# EAGLE design c100_rev_c (EAGLE 7.6.0)
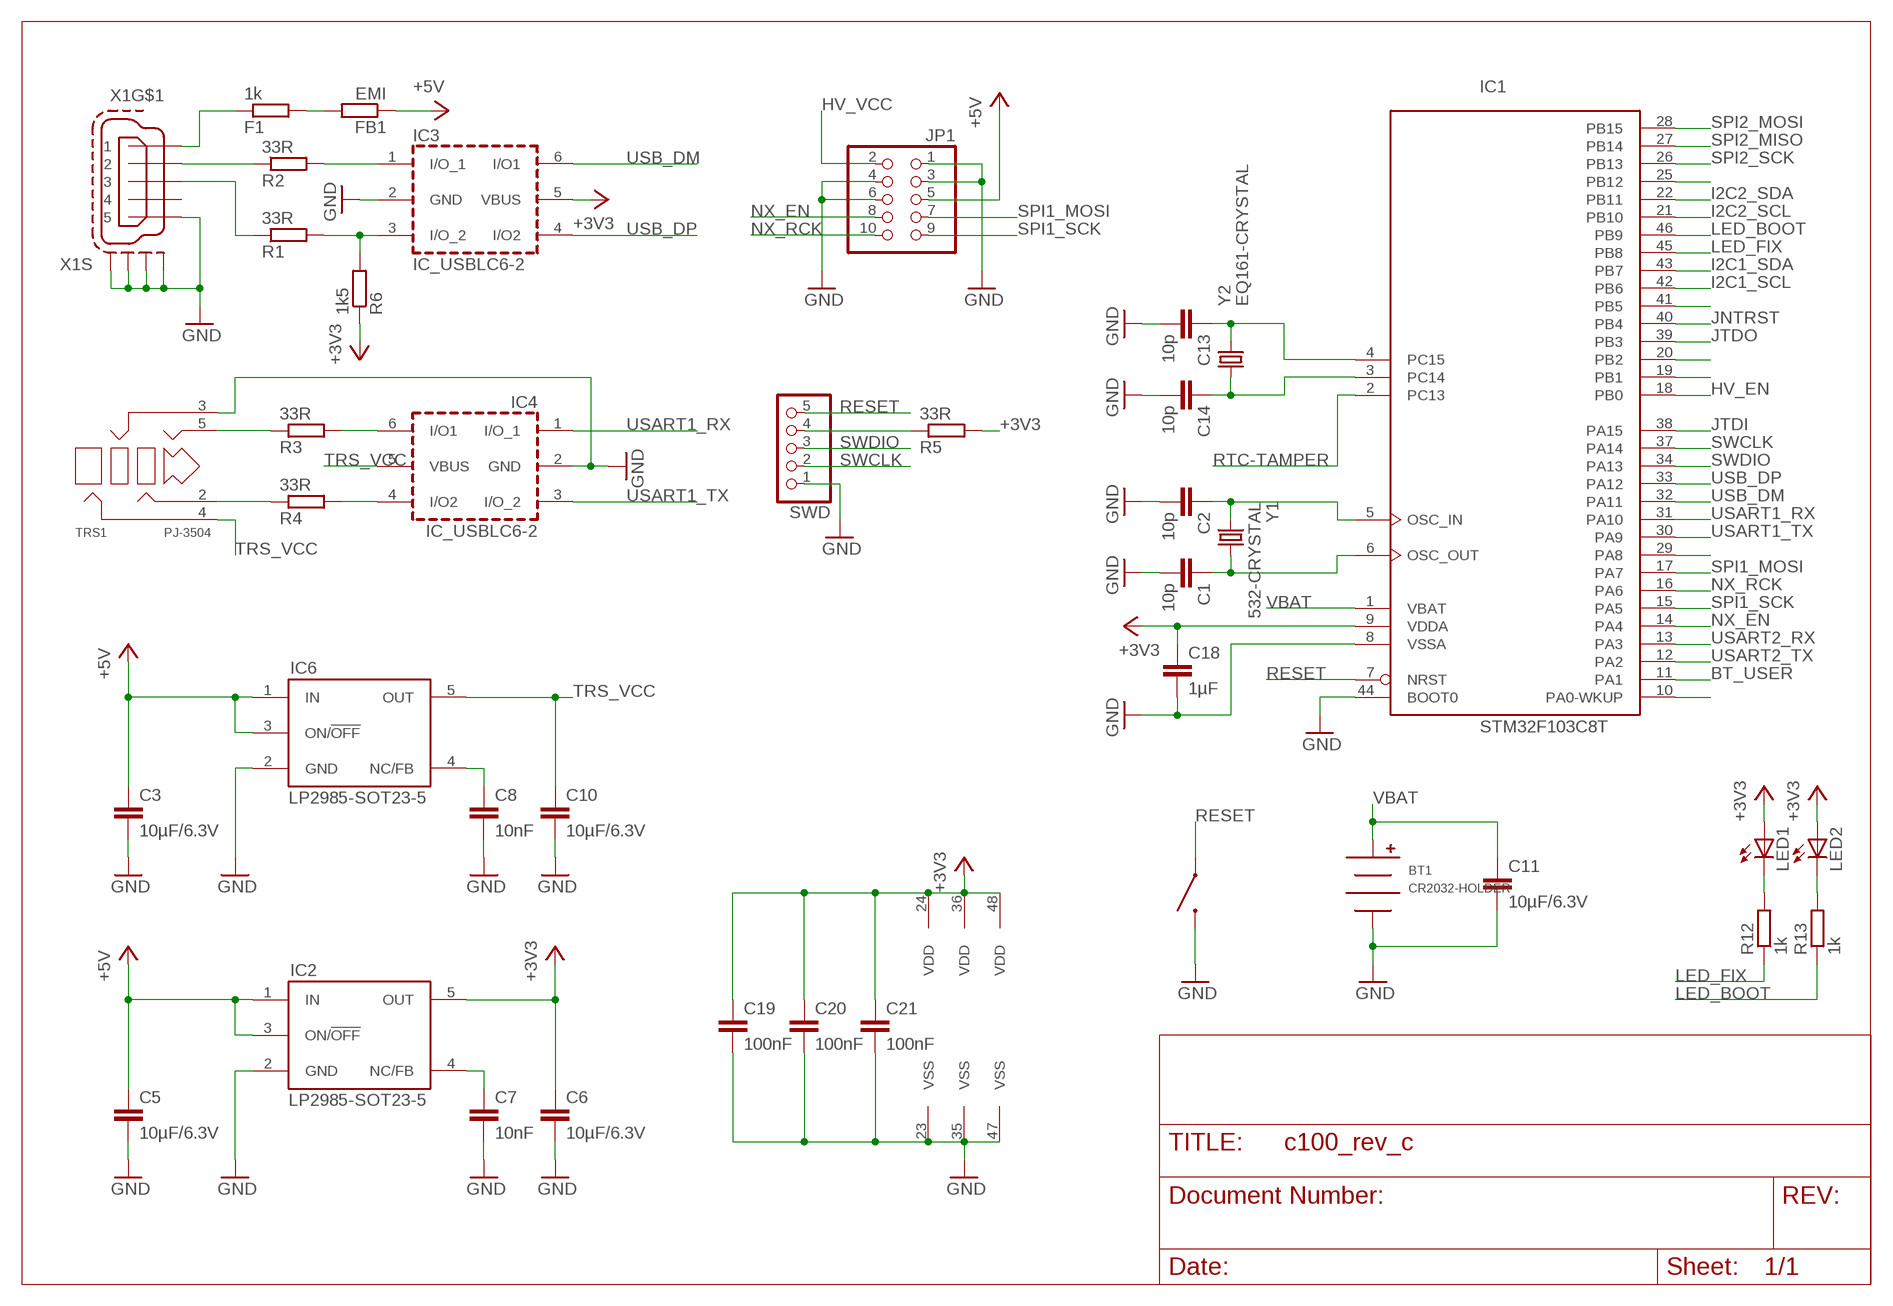
[diagram p0: schematic, sheet 1, part 1 of 2]
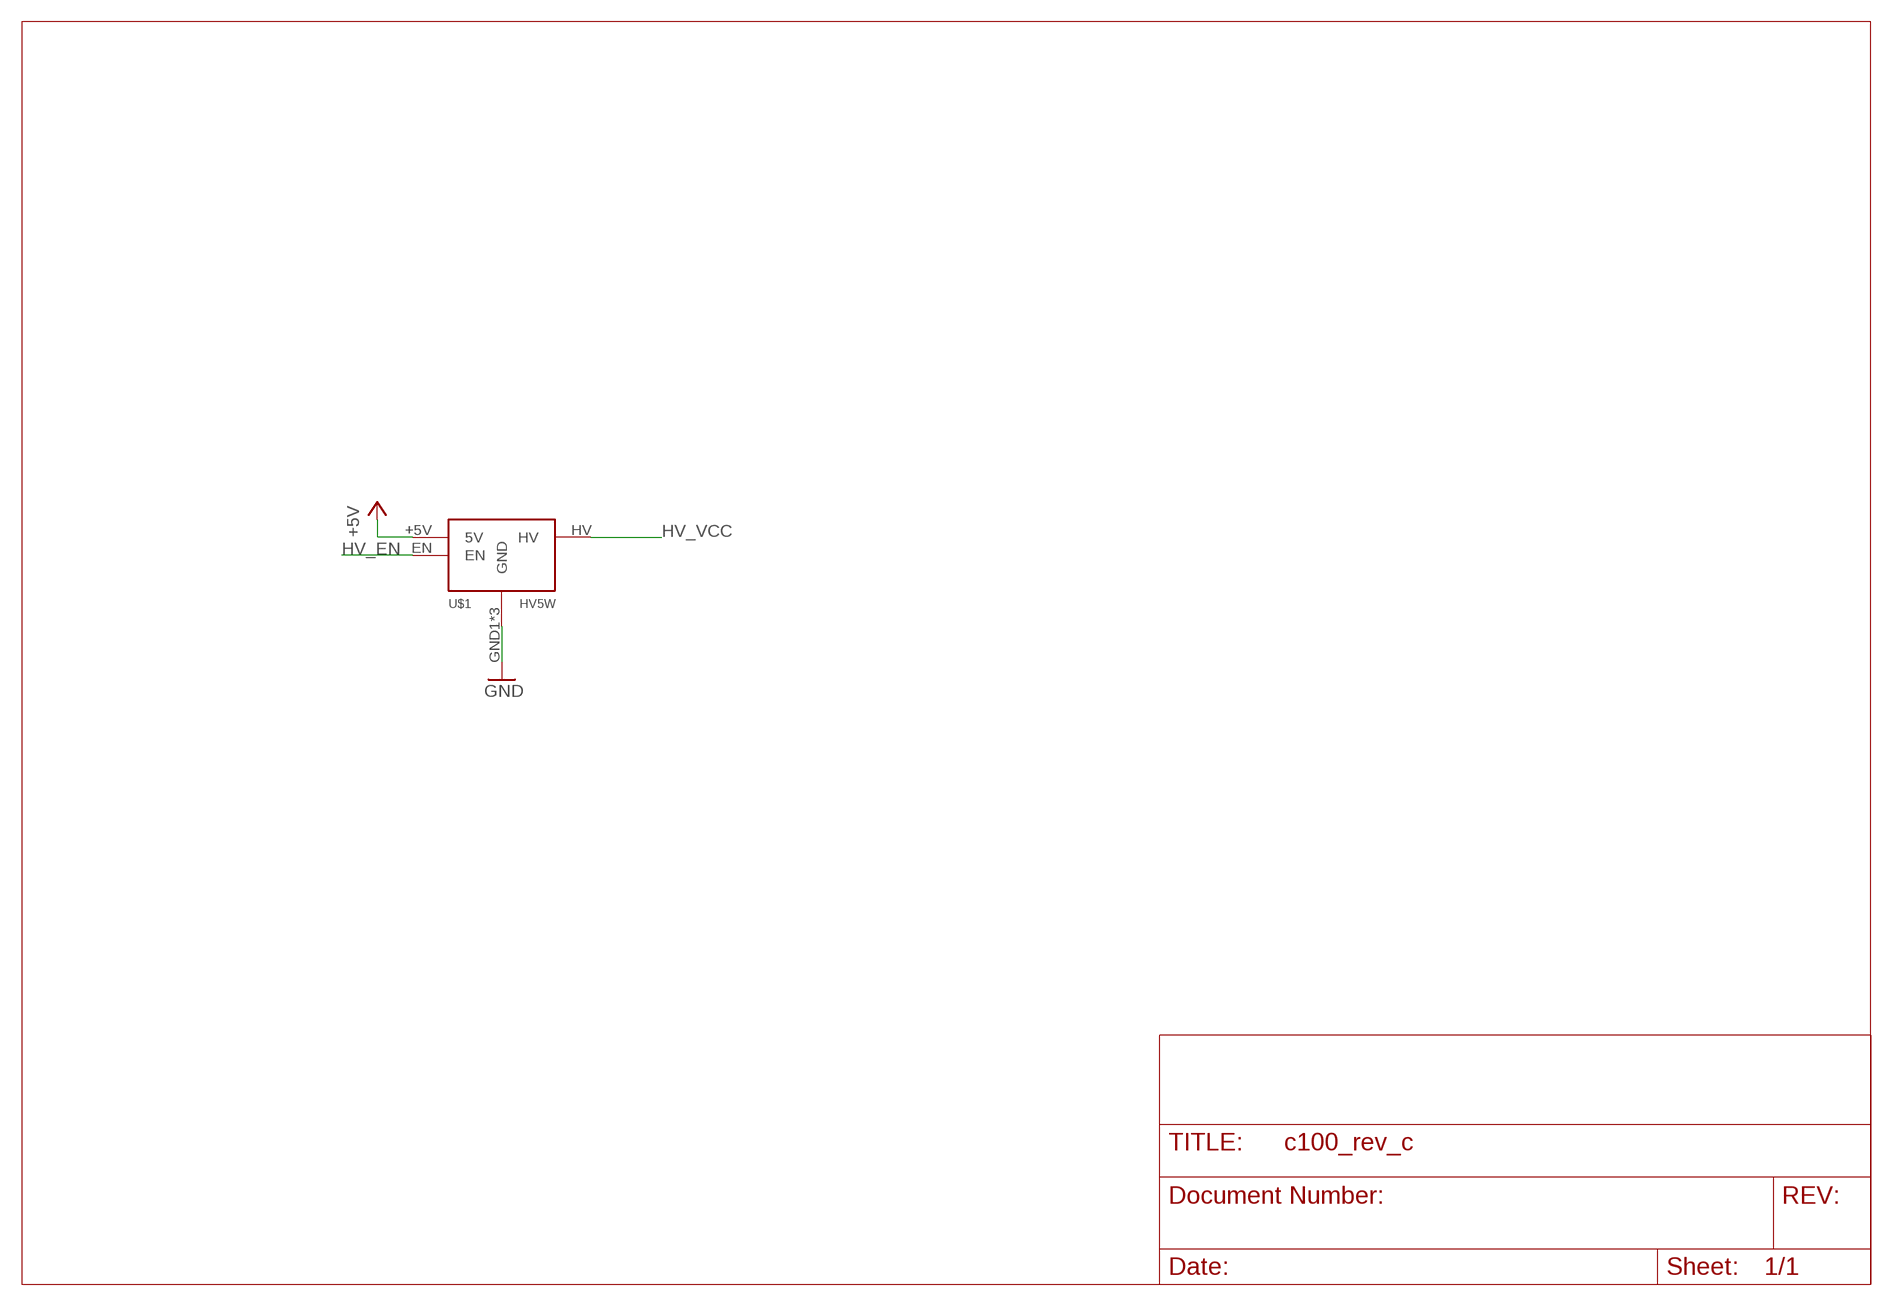
[diagram p1: schematic, sheet 1, part 2 of 2]

## Parts
BT1  CR2032-HOLDER  [CH28-2032LF]
C1  10p  C-EUC0603  [C0603]
C2  10p  C-EUC0603  [C0603]
C3  10µF/6.3V  C-EUC0603  [C0603]
C5  10µF/6.3V  C-EUC0603  [C0603]
C6  10µF/6.3V  C-EUC0603  [C0603]
C7  10nF  C-EUC0603  [C0603]
C8  10nF  C-EUC0603  [C0603]
C10  10µF/6.3V  C-EUC0603  [C0603]
C11  10µF/6.3V  C-EUC0603  [C0603]
C13  10p  C-EUC0603  [C0603]
C14  10p  C-EUC0603  [C0603]
C18  1µF  C-EUC0603  [C0603]
C19  100nF  C-EUC0603  [C0603]
C20  100nF  C-EUC0603  [C0603]
C21  100nF  C-EUC0603  [C0603]
F1  1k  R-EU_R0603  [R0603]
FB1  EMI  R-EU_R0603  [R0603]
IC1  STM32F103C8T  [LQFP48]
IC2  LP2985-SOT23-5  [SOT23-5]
IC3  IC_USBLC6-2  [SOT-23-6L]
IC4  IC_USBLC6-2  [SOT-23-6L]
IC6  LP2985-SOT23-5  [SOT23-5]
ISP  TACT-SWITCH-40-40  [40-40]
JP1  PINHD-2X5_2.54-SMD  [2X05SMD]
LED1  LEDCHIP-LED0603  [CHIP-LED0603]
LED2  LEDCHIP-LED0603  [CHIP-LED0603]
R1  33R  R-EU_R0603  [R0603]
R2  33R  R-EU_R0603  [R0603]
R3  33R  R-EU_R0603  [R0603]
R4  33R  R-EU_R0603  [R0603]
R5  33R  R-EU_R0603  [R0603]
R6  1k5  R-EU_R0603  [R0603]
R12  1k  R-EU_R0603  [R0603]
R13  1k  R-EU_R0603  [R0603]
SWD  HEADER-1X5ROUND  [1X05_ROUND]
TRS1  PJ-3504  [YD-PJ-3504]
U$1  HV5W  [HV5W-D]
X1  MINI-USB-SCHIELD-32005-201  [32005-201]
Y1  532-CRYSTAL  [2PIN50X32]
Y2  EQ161-CRYSTAL  [EQ161]

## Nets
+3V3: C6.1 C18.1 C19.1 C20.1 C21.1 IC1.9(VDDA) IC1.24(VDD) IC1.36(VDD) IC1.48(VDD) IC2.5(OUT) IC3.5(VBUS) LED1.A LED2.A R5.2 R6.1
+5V: C3.1 C5.1 FB1.1 IC2.1(IN) IC2.3(ON/!OFF) IC6.1(IN) IC6.3(ON/!OFF) JP1.5 U$1.+5V(5V)
ASDAWJIODJA: R5.1 SWD.4
BT_USER: IC1.11(PA1)
GND: BT1.NEG C1.2 C2.2 C3.2 C5.2 C6.2 C7.2 C8.2 C10.2 C11.2 C13.2 C14.2 C18.2 C19.2 C20.2 C21.2 IC1.8(VSSA) IC1.23(VSS) IC1.35(VSS) IC1.44(BOOT0) IC1.47(VSS) IC2.2(GND) IC3.2(GND) IC4.2(GND) IC6.2(GND) ISP.1 ISP.2 JP1.1 JP1.3 JP1.4 JP1.6 SWD.1 TRS1.3 U$1.GND1(GND) U$1.GND2(GND) U$1.GND3(GND) X1.5 X1.M1(S:S1) X1.M2(S:S2) X1.M3(S:S3) X1.M4(S:S4)
HV_EN: IC1.18(PB0) U$1.EN
HV_VCC: JP1.2 U$1.HV
I2C1_SCL: IC1.42(PB6)
I2C1_SDA: IC1.43(PB7)
I2C2_SCL: IC1.21(PB10)
I2C2_SDA: IC1.22(PB11)
JNTRST: IC1.40(PB4)
JTDI: IC1.38(PA15)
JTDO: IC1.39(PB3)
LED_BOOT: IC1.46(PB9) R13.1
LED_FIX: IC1.45(PB8) R12.1
N$1: C1.1 IC1.6(OSC_OUT) Y1.P$1
N$2: C2.1 IC1.5(OSC_IN) Y1.P$2
N$3: F1.1 X1.1
N$4: C8.1 IC6.4(NC/FB)
N$5: IC3.3(I/O_2) R1.2 R6.2
N$7: IC4.6(I/O1) R3.2
N$10: LED2.C R13.2
N$11: LED1.C R12.2
N$12: R4.1 TRS1.2
N$20: C7.1 IC2.4(NC/FB)
N$22: F1.2 FB1.2
N$23: IC3.1(I/O_1) R2.2
N$24: R2.1 X1.2
N$25: IC4.4(I/O2) R4.2
N$28: R3.1 TRS1.5
N$29: C13.1 IC1.4(PC15) Y2.P$1
N$30: C14.1 IC1.3(PC14) Y2.P$2
N$32: IC1.19(PB1)
N$34: IC1.20(PB2)
N$36: R1.1 X1.3
N$38: IC1.29(PA8)
N$42: IC1.10(PA0-WKUP)
N$48: IC1.41(PB5)
N$55: IC1.25(PB12)
NX_EN: IC1.14(PA4) JP1.8
NX_RCK: IC1.16(PA6) JP1.10
RESET: IC1.7(NRST) ISP.3 ISP.4 SWD.5
RTC-TAMPER: IC1.2(PC13)
SPI1_MOSI: IC1.17(PA7) JP1.7
SPI1_SCK: IC1.15(PA5) JP1.9
SPI2_MISO: IC1.27(PB14)
SPI2_MOSI: IC1.28(PB15)
SPI2_SCK: IC1.26(PB13)
SWCLK: IC1.37(PA14) SWD.2
SWDIO: IC1.34(PA13) SWD.3
TRS_VCC: C10.1 IC4.5(VBUS) IC6.5(OUT) TRS1.4
USART1_RX: IC1.31(PA10) IC4.1(I/O_1)
USART1_TX: IC1.30(PA9) IC4.3(I/O_2)
USART2_RX: IC1.13(PA3)
USART2_TX: IC1.12(PA2)
USB_DM: IC1.32(PA11) IC3.6(I/O1)
USB_DP: IC1.33(PA12) IC3.4(I/O2)
VBAT: BT1.POS C11.1 IC1.1(VBAT)
Unconnected: X1.4

## Library data of the parts
BT1 = battery-holder:CR2032-HOLDER
C1-C3 C5-C8 C10 C11 C13 C14 C18-C21 = rcl:C-EU: CAPACITOR, European symbol
F1 FB1 R1-R6 R12 R13 = rcl:R-EU_: RESISTOR, European symbol
IC1 = micro-stm_v3:STM32F103C*T: ARM 32-bit Cortex™-M3 CPU 72 MHz maximum frequency 16 to 128 Kbytes of Flash memory 6 to 20 kbytes of SRAM 37 GPIOs 2.0 to 3.6 V application supply
IC2 IC6 = vreg:LP2985
IC3 IC4 = dp_devices:IC_USBLC6-2
ISP = tactile-switch:TACT-SWITCH-40-40
JP1 = con-pinhead:PINHD-2X5: PIN HEADER
LED1 LED2 = led:LED: LED OSRAM: - CHIPLED LG R971, LG N971, LY N971, LG Q971, LY Q971, LO R971, LY R971 LH N974, LH R974 LS Q976, LO Q976, LY Q976 LO Q996 - Hyper CHIPLED LW Q18S LB Q993, LB Q99A, LB R99A - SideLED LS A670, LO A670, LY A670, LG A670, LP A670 LB A673, LV A673, LT A673, LW A673 LH A674 LY A675 LS A676, LA A676, LO A676, LY A676, LW A676 LS A679, LY A679, LG A679 - Hyper Micro SIDELED® LS Y876, LA Y876, LO Y876, LY Y876 LT Y87S - SmartLED LW L88C, LW L88S LB L89C, LB L89S, LG L890 LS L89K, LO L89K, LY L89K LS L896, LA L896, LO L896, LY L896 - TOPLED LS T670, LO T670, LY T670, LG T670, LP T670 LSG T670, LSP T670, LSY T670, LOP T670, LYG T670 LG T671, LOG T671, LSG T671 LB T673, LV T673, LT T673, LW T673 LH T674 LS T676, LA T676, LO T676, LY T676, LB T676, LH T676, LSB T676, LW T676 LB T67C, LV T67C, LT T67C, LS T67K, LO T67K, LY T67K, LW E67C LS E67B, LA E67B, LO E67B, LY E67B, LB E67C, LV E67C, LT E67C LW T67C LS T679, LY T679, LG T679 LS T770, LO T770, LY T770, LG T770, LP T770 LB T773, LV T773, LT T773, LW T773 LH T774 LS E675, LA E675, LY E675, LS T675 LS T776, LA T776, LO T776, LY T776, LB T776 LHGB T686 LT T68C, LB T68C - Hyper Mini TOPLED® LB M676 - Mini TOPLED Santana® LG M470 LS M47K, LO M47K, LY M47K Source: http://www.osram.convergy.de LUXEON: - LUMILED® LXK2-PW12-R00, LXK2-PW12-S00, LXK2-PW14-U00, LXK2-PW14-V00 LXK2-PM12-R00, LXK2-PM12-S00, LXK2-PM14-U00 LXK2-PE12-Q00, LXK2-PE12-R00, LXK2-PE12-S00, LXK2-PE14-T00, LXK2-PE14-U00 LXK2-PB12-K00, LXK2-PB12-L00, LXK2-PB12-M00, LXK2-PB14-N00, LXK2-PB14-P00, LXK2-PB14-Q00 LXK2-PR12-L00, LXK2-PR12-M00, LXK2-PR14-Q00, LXK2-PR14-R00 LXK2-PD12-Q00, LXK2-PD12-R00, LXK2-PD12-S00 LXK2-PH12-R00, LXK2-PH12-S00 LXK2-PL12-P00, LXK2-PL12-Q00, LXK2-PL12-R00 Source: www.luxeon.com KINGBRIGHT: KA-3528ASYC Source: www.kingbright.com
SWD = microbuilder:HEADER-1X5: PIN HEADER
TRS1 = con-trs:PJ-3504
U$1 = hv-mod:HV5W
X1 = con-cypressindustries:MINI-USB-SCHIELD-: MINI USB-B Conector Source: www.cypressindustries.com; OC_FARNELL: unknown; OC_NEWARK: unknown
Y1 = euroquartz:532-CRYSTAL
Y2 = euroquartz:EQ161-CRYSTAL: ￼Miniature SMD 3.2 x 1.5 x 0.75mm

## Board
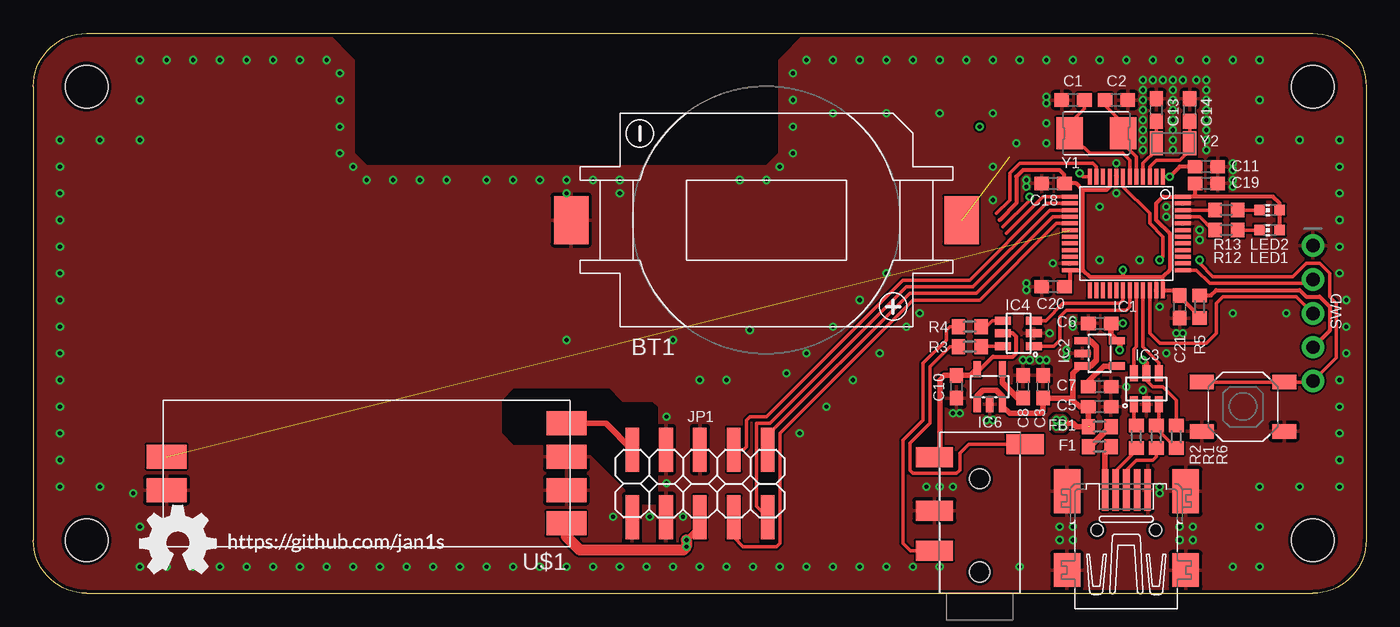
[diagram p2: board, top side]
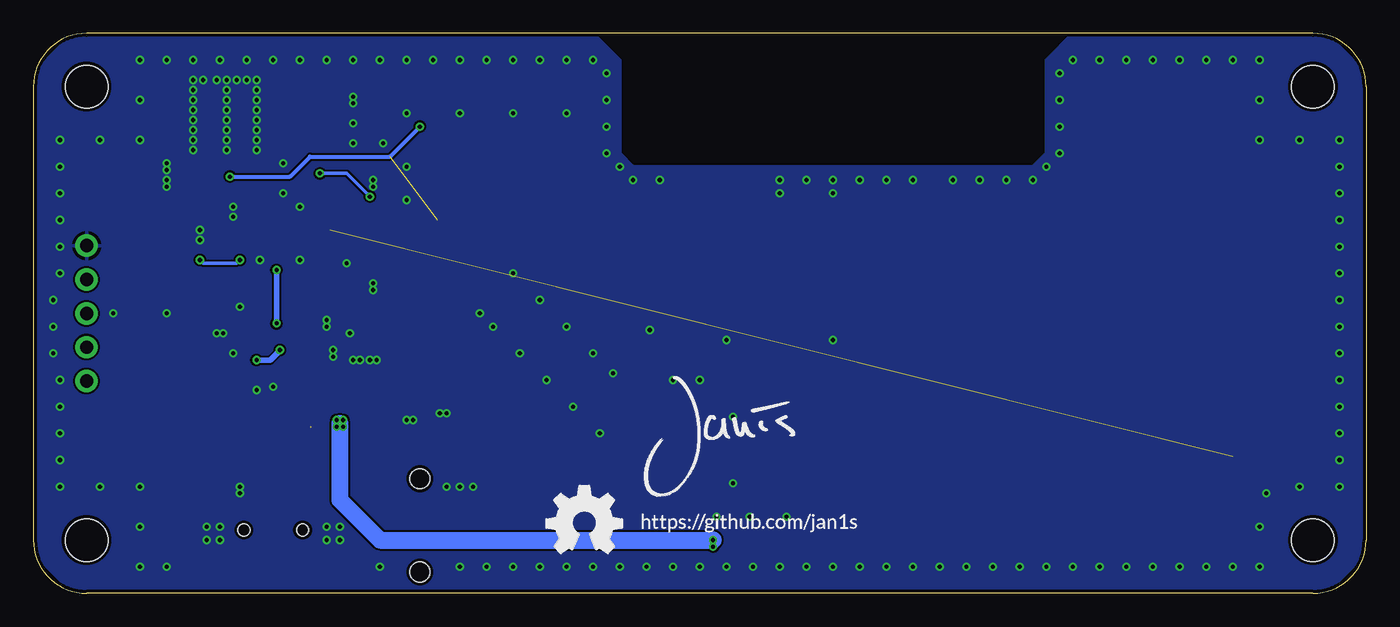
[diagram p3: board, bottom side, seen from below]

Size 100 x 42 mm. Coordinates in mm from the lower left corner, seen from the top.
Outline: 4,0 96,0 arc90 100,4 100,38 arc90 96,42 4,42 arc90 0,38 0,4 arc90 4,0
Copper layers (1*16): Top 0.035mm / dielectric 1.5mm / Bottom 0.035mm
Design rules "default": minimum track width 6mil, minimum drill 12mil, track to track 6mil, track to pad 6mil, pad to pad 6mil, via to via 6mil, smd to smd 0mil, copper to edge 10mil, drill to drill 10mil, minimum pad ring 10mil, minimum via ring 6mil, stop-mask expansion 2mil, vias tented up to drill 100mil, thermal gap 10mil
Holes 3.2 mm at 4,38 96,38 96,4 4,4

### Footprints (pad centres in the part's own frame; a part is rotated, then mirrored left to right if it is on the bottom)
CH28-2032LF = smd 3.6 x 2.6: NEG 0,-14.65; POS 0,14.65
C0603 = smd 1.1 x 1: 1 -0.85,0; 2 0.85,0
R0603 = smd 1 x 1.1: 1 -0.85,0; 2 0.85,0
LQFP48 = smd 0.3 x 1.2: 1 -2.75,-4.25; 2 -2.25,-4.25; 3 -1.75,-4.25; 4 -1.25,-4.25; 5 -0.75,-4.25; 6 -0.25,-4.25; 7 0.25,-4.25; 8 0.75,-4.25; 9 1.25,-4.25; 10 1.75,-4.25; 11 2.25,-4.25; 12 2.75,-4.25; 25 2.75,4.25; 26 2.25,4.25; 27 1.75,4.25; 28 1.25,4.25; 29 0.75,4.25; 30 0.25,4.25; 31 -0.25,4.25; 32 -0.75,4.25; 33 -1.25,4.25; 34 -1.75,4.25; 35 -2.25,4.25; 36 -2.75,4.25 | smd 1.2 x 0.3: 13 4.25,-2.75; 14 4.25,-2.25; 15 4.25,-1.75; 16 4.25,-1.25; 17 4.25,-0.75; 18 4.25,-0.25; 19 4.25,0.25; 20 4.25,0.75; 21 4.25,1.25; 22 4.25,1.75; 23 4.25,2.25; 24 4.25,2.75; 37 -4.25,2.75; 38 -4.25,2.25; 39 -4.25,1.75; 40 -4.25,1.25; 41 -4.25,0.75; 42 -4.25,0.25; 43 -4.25,-0.25; 44 -4.25,-0.75; 45 -4.25,-1.25; 46 -4.25,-1.75; 47 -4.25,-2.25; 48 -4.25,-2.75
SOT23-5 = smd 0.55 x 1.2: 1 -0.95,-1.3; 2 0,-1.3; 3 0.95,-1.3; 4 0.95,1.3; 5 -0.95,1.3
SOT-23-6L = smd 0.6 x 1.2: 1 -0.95,-2.3; 2 0,-2.3; 3 0.95,-2.3; 4 0.95,0; 5 0,0; 6 -0.95,0
40-40 = smd 1.8 x 1.1: 1 -3.1,1.85; 2 3.1,1.85; 3 -3.1,-1.85; 4 3.1,-1.85
2X05SMD = smd 1.016 x 3.302: 1 -1.27,-3.81; 2 -1.27,1.27; 3 1.27,-3.81; 4 1.27,1.27; 5 3.81,-3.81; 6 3.81,1.27; 7 6.35,-3.81; 8 6.35,1.27; 9 8.89,-3.81; 10 8.89,1.27
CHIP-LED0603 = smd 0.8 x 0.8: A 0,-0.75; C 0,0.75
1X05_ROUND = drill 1 pad 1.676: 1 -5.08,0; 2 -2.54,0; 3 0,0; 4 2.54,0; 5 5.08,0
YD-PJ-3504 = smd 1.5 x 2.8: 2 3.2,3.4; 3 6.2,3.4; 4 10.2,3.4; 5 11.2,-3.4 | hole 1.5: 1.6,0; 8.6,0
HV5W-D = smd 3 x 1.8: +5V -15,3.75; EN 15,-1.25; GND1 15,1.25; GND2 -15,-1.25; GND3 -15,1.25; HV -15,-3.75
32005-201 = smd 3.1 x 0.5: 1 3,1.6; 2 3,0.8; 3 3,0; 4 3,-0.8; 5 3,-1.6 | smd 2.5 x 2: M1 -3,-4.45; M2 -3,4.45 | smd 3.3 x 2: M3 2.9,4.45; M4 2.9,-4.45 | hole 0.9: 0,2.2; 0,-2.2
2PIN50X32 = smd 2 x 2.4: P$1 -2,0; P$2 2,0
EQ161 = smd 1 x 1.8: P$1 -1.25,0; P$2 1.25,0

### Placement (x,y rotation side)
BT1  55,28 270 top
C1  78,37 180 top
C2  81.25,37 0 top
C3  75.75,15.5 90 top
C5  80,14 0 top
C6  80,20.25 180 top
C7  80,15.5 0 top
C8  74.25,15.5 90 top
C10  69.25,15.5 270 top
C11  88,32 0 top
C13  84.25,36.25 90 top
C14  86.75,36.25 90 top
C18  76.5,30.75 180 top
C19  88,30.75 0 top
C20  76.5,23 180 top
C21  86,21.5 270 top
F1  80,11 180 top
FB1  80,12.5 0 top
IC1  82,27 180 top
IC2  80,18 270 top
IC3  83.5,16.5 0 top
IC4  72.75,19.5 90 top
IC6  71.75,15.5 0 top
ISP  90.75,14 180 top
JP1  46.2,9.5 0 top
LED1  92.75,27.25 90 top
LED2  92.75,28.75 90 top
LOGO1  OSHW_LOGO_FILLX0200-NT  [OSHW_FILLX200_NOTEXT]  8,1.5 0 top
LOGO2  OSHW_LOGO_FILLX0200-NT  [OSHW_FILLX200_NOTEXT]  61.5,3 0 bottom
R1  84.25,11.75 90 top
R2  82.75,11.75 90 top
R3  70.25,18.5 0 top
R4  70.25,20 0 top
R5  87.5,21.5 270 top
R6  85.75,11.75 270 top
R12  89.5,27.25 0 top
R13  89.5,28.75 0 top
SWD  96,21 270 top
TRS1  71,0 90 top
U$1  25,9 180 top
U$2  [JANIS_10MM]  54.5,7 0 bottom
U$5  [GITHUB/JAN1S]  14.5,3.25 0 top
U$6  [GITHUB/JAN1S]  54.5,4.75 0 bottom
X1  82,4.75 90 top
Y1  79.75,34.5 0 top
Y2  85.5,33.75 0 top

### Tracks (layer width: path | path; a pad name or v marks a point on that pad's centre or on a via)
+3V3  (via drill 0.32)
  Top 0.254: R6.1 85.75,14.5 84.75,15.5 84,15.5 83.5,16 IC3.5
  Top 0.305: C20.1 77.75,23.4 IC1.24 78.75,24.25 | IC1.9 80.75,30.5 80.5,30.25 78.75,30.25 | 78.75,30.25 78.25,30.75 C18.1 77.35,31.4 77,31.75 74.25,31.75 73.75,31.25 73.75,29.25 72.5,28 | 78.75,24.25 78.75,30.25 | LED1.A LED2.A 93.5,29.25 93,29.75 87,29.75 | 87,29.75 IC1.48 84.75,29.75 84.25,29.25 84.25,28 85.25,27 85.25,24.25 84.75,23.75 | 84.75,23.75 IC1.36 85.6,22.75 C21.1 86,22.25 87.5,20.75 R5.2 | 78.75,24.25 79.25,23.75 81.75,23.75 | 81.75,23.75 84.75,23.75 | v81.75,24.25 81.75,23.75 | C19.1 87.15,29.9 87,29.75
  Top 0.406: IC3.5 83.5,17.25 v83.25,17.5 | v81.5,18.25 81.5,18.75 IC2.5 80.85,19.4 C6.1 v81.75,20.25
  Bottom 0.406: v83.25,17.5 82.25,17.5 v81.5,18.25 | v81.75,20.25 v81.75,24.25
+5V  (via drill 0.32)  (1 unrouted)
  Top 0.406: FB1.1 C5.1 78.5,14 78,14.5 | 78,14.5 78,16.5 78.55,17.05 IC2.3 79.3,17.05 79.75,17.5 79.75,18.5 79.3,18.95 IC2.1 | IC6.1 70.8,14.8 71.25,15.25 72.25,15.25 72.7,14.8 IC6.3 72.7,14.05 73.25,13.5 75.5,13.5 75.75,13.75 C3.1 | v49,4 50,5 JP1.5 50.01,6.99 | 77.25,12.75 78,12.75 78.25,12.5 79.25,12.5 | C3.1 75.75,14.75 76,15 | C3.1 77.85,14.65 78,14.5
  Top 0.813: v49,4 v49,3.5 48.75,3.25 41,3.25 40,4.25 U$1.+5V
  Bottom 0.254: 77,12.75 v76.75,13
  Bottom 1.27: v49,4 74,4 77,7 77,12.75
  other vias: 77.25,13 77.25,12.5 76.75,12.5
  pour Top: 76.5,13 76.5,12.5 76.75,12.25 77.25,12.25 77.5,12.5 77.5,13 77.25,13.25 76.75,13.25
ASDAWJIODJA
  Top 0.305: R5.1 88.35,22.35 88.75,22.75 95,22.75 95.5,22.25 96.5,22.25 97.25,21.5 97.25,19.71 SWD.4
BT_USER
  Top 0.254: IC1.11 79.75,32 79.5,32.25 74,32.25 73.25,31.5 73.25,29.5 72.25,28.5
GND  (via drill 0.32)
  other vias: 98,16 98.5,18 92,5 98,14 98,12 52,2 92,40 88,40 86,40 84,40 82,40 80,40 76,40 74,40 72,40 66,40 64,40 62,40 60,40 58,40 22,40 20,40 18,40 16,40 14,40 12,40 10,40 8,40 2,34 2,32 2,30 2,28 2,26 2,24 2,22 2,20 2,18 2,16 2,14 2,12 2,10 2,8 8,2 10,2 12,2 14,2 16,2 18,2 20,2 22,2 24,2 26,2 28,2 30,2 32,2 34,2 36,2 38,2 42,2 44,2 50,2 54,2 56,2 58,2 60,2 98,34 98,32 98,30 68,40 70,40 92,2 90,2 95,8 98,28 98,26 98,24 98.5,22 98.5,20 46,2 48,2 40,2 78,40 90,40 43.5,5.75 7.5,7.5 5,8 8,5 8,34 8,37 5,34 92,8 98,8 98,10 76.25,19.5 74.25,17.5 74.75,17.5 81.25,30 81.25,32.25 74.5,31 85,29 86.25,19.5 62,2 64,2 66,2 68,2 74,2 92,37 92,34 95,34 68,36 80,25 72,36 74.5,30.5 76.5,24.75 74.5,23.25 74.5,22.75 84.5,21.5 85.75,19.5 85,28.25 87.5,27.25 87.5,26.5 90,31 90,30.5 85.5,33.25 85.5,34 85.5,34.75 85.5,35.5 85.5,36.25 85.5,37 85.5,37.75 85.5,38.5 86.25,38.5 87.25,38.5 84.75,38.5 84,38.5 88,33.25 88,34 88,34.75 88,35.5 88,36.25 88,37 88,37.75 88,38.5 83.25,34.75 76,36.75 76,37.25 83.25,38.5 83.25,37 83.25,37.75 83.25,36.25 83.25,34 83.25,33.25 83.25,35.5 78,20.5 78,20 77.5,18.25 77.5,17.75 83.25,15.25 82,15.5 69,13.5 69.5,13.5 75.5,17.5 76,17.5 71.5,13 72,13 77,4 78,4 86,4 87,4 84.5,8 84.5,7.5 86,5 87,5 78,5 77,5 67,8 68,8 69,8 47.5,8.25 48.75,5.75 46.25,5.75 47.5,13.25 72,32 50,16 60,36 64,36 40,19 48,19 53.75,19.75 52,16 44,30 40,30 34,31 23,39 23,37 24,32 25,31 23,35 23,33 27,31 29,31 31,31 36,31 38,31 40,31 42,31 44,31 57,39 57,37 57,35 57,33 56,32 55,31 53,31 80,29 83,25 85,18 90,21 94,21 66.5,21 57.5,12 59.5,14 61.5,16 63.5,18 65.5,20 64,24 62,22 60,20 58,18 56.5,16.5 72,29.5 90,31.75 90,32.25 73.75,33.75 76,33.75 76,35.25
  pour Top (rank 5): 3,42 22,42 24,40 24,33 25,32 55,32 56,33 56,40 58,42 97,42 100,39 100,3 97,0 47,0 47,14 46.5,14.5 44.25,14.5 43.25,15.5 36,15.5 35,14.5 35,12 36,11 41,11 45.5,6.5 45.5,0 3,0 0,3 0,39
  pour Bottom: 3,42 22,42 24,40 24,33 25,32 55,32 56,33 56,40 58,42 97,42 100,39 100,3 97,0 21.5,0 21.5,-2 16,-2 16,0 3,0 0,3 0,39
  pour Top: 45.5,0 49.5,0 49.5,6.5 45.5,6.5
HV_EN  (1 unrouted)
HV_VCC
  Top 0.406: U$1.HV 42.95,12.75 JP1.2
LED_BOOT
  Top 0.254: IC1.46 R13.1
LED_FIX
  Top 0.254: IC1.45 87.5,28.25 88.5,27.25 R12.1
N$1
  Top 0.254: IC1.6 82.25,32.5 81.75,33 79.25,33 78.25,34 78.25,34.25 Y1.P$1 78,35.5 78.85,36.35 C1.1
N$2
  Top 0.254: IC1.5 82.75,32.75 81.75,33.75 Y1.P$2 82,35 80.4,36.6 C2.1
N$3
  Top 0.406: X1.1 80.4,10.55 F1.1
N$4
  Top 0.406: C8.1 73.85,14.65 72.7,15.8 IC6.4
N$5
  Top 0.254: IC3.3 84.45,12.8 R1.2 84.25,12.4 R6.2
N$7
  Top 0.254: IC4.6 71.15,18.55 R3.2
N$10
  Top 0.254: R13.2 LED2.C
N$11
  Top 0.254: R12.2 LED1.C
N$12
  Top 0.254: TRS1.2 65.8,3.2 65.25,3.75 65.25,11.5 66.75,13 66.75,17.25 68.5,19 68.5,19.75 68.75,20 R4.1
N$20
  Top 0.406: C7.1 79.15,15.9 80.3,17.05 IC2.4
N$22
  Top 0.406: F1.2 79.25,11 80.75,12.5 FB1.2
N$23
  Top 0.254: IC3.1 82.55,12.8 R2.2
N$24
  Top 0.254: X1.2 81.2,9.2 82.75,10.75 R2.1
N$25
  Top 0.254: R4.2 71.5,20 71.95,20.45 IC4.4
N$28
  Top 0.254: R3.1 68.75,18.5 67.25,17 67.25,12.75 65.75,11.25 65.75,9.25 66,9 69.25,9 69.5,9.25 69.5,10.5 70.2,11.2 TRS1.5 74.25,11.2
N$29
  Top 0.254: IC1.4 83.25,32.25 84.25,33.25 Y2.P$1 C13.1
N$30
  Top 0.254: IC1.3 83.75,32 84.25,32.5 86,32.5 86.75,33.25 Y2.P$2 C14.1
N$36
  Top 0.254: X1.3 82,9.25 82.75,10 84,10 84.25,10.25 R1.1
NX_EN
  Top 0.254: JP1.8 53.27,10.77 53.5,11 53.5,13 53.75,13.25 55,13.25 65.25,23.5 70.25,23.5 76,29.25 IC1.14
NX_RCK
  Top 0.254: JP1.10 55.09,11.84 65.75,22.5 70.75,22.5 76.5,28.25 IC1.16
RESET  (via drill 0.32)
  Top 0.254: IC1.7 81.75,30.5 83.75,28.5 83.75,27.75 84.75,26.75 84.75,25.25 v84.5,25 | v87.5,25 87.5,24.75 88.5,23.75 94.5,23.75 95.5,24.75 96.5,24.75 97.25,24 97.25,22.25 97.75,21.75 97.75,17.67 SWD.5 95.93,15.85 ISP.3 ISP.4
  Bottom 0.254: v84.5,25 84.75,24.75 87.25,24.75 v87.5,25
SPI1_MOSI
  Top 0.254: JP1.7 52.55,4.2 53.25,3.5 55.75,3.5 56,3.75 56,12 66,22 71,22 76.75,27.75 IC1.17
SPI1_SCK
  Top 0.254: JP1.9 54.25,6.53 54.25,12.75 55.25,12.75 65.5,23 70.5,23 76.25,28.75 IC1.15
SWCLK
  Top 0.254: IC1.37 87.25,24.25 88.25,23.25 95.75,23.25 96,23.5 SWD.2
SWDIO
  Top 0.254: IC1.34 83.75,19.5 84.5,18.75 88,18.75 88.75,19.5 88.75,21.75 89.25,22.25 94.75,22.25 SWD.3
TRS_VCC
  Top 0.305: IC6.5 71.05,16.8 72,17.75 73.5,17.75 73.75,18 73.75,19.25 73.5,19.5 IC4.5
  Top 0.406: IC6.5 70.35,16.35 C10.1 68.35,16.35 68,16 68,10.5 | 68,10.5 68,10.45 TRS1.4 | 67.75,10.25 68,10.5
USART1_RX
  Top 0.254: IC1.31 82.25,21.5 82,21.25 77.5,21.25 77,20.75 77,19 76.55,18.55 IC4.1
USART1_TX
  Top 0.254: IC1.30 81.75,22 81.5,21.75 77.25,21.75 75.95,20.45 IC4.3
USART2_RX
  Top 0.254: IC1.13 75.75,29.75 73,27
USART2_TX  (via drill 0.32)
  Top 0.254: IC1.12 78.75,31.25 v78.5,31.5 | v74.75,29.75 74.75,29.5 72.75,27.5
  Bottom 0.254: v78.5,31.5 76.5,31.5 v74.75,29.75
USB_DM
  Top 0.254: IC3.6 82.55,18.3 82.75,18.5 IC1.32
USB_DP
  Top 0.254: IC3.4 84.45,17.3 83.25,18.5 IC1.33
VBAT  (via drill 0.32)  (1 unrouted)
  Top 0.254: IC1.1 v85.25,31.25
  Top 0.305: C11.1 86,32 v85.25,31.25
  Bottom 0.305: v85.25,31.25 80.75,31.25 79.25,32.75 73.25,32.75 v71,35

### Text on the board
tValues: GND | SWCLK | SWDIO | VCC | RST